# EAGLE design led_heart (EAGLE 7.5.0)
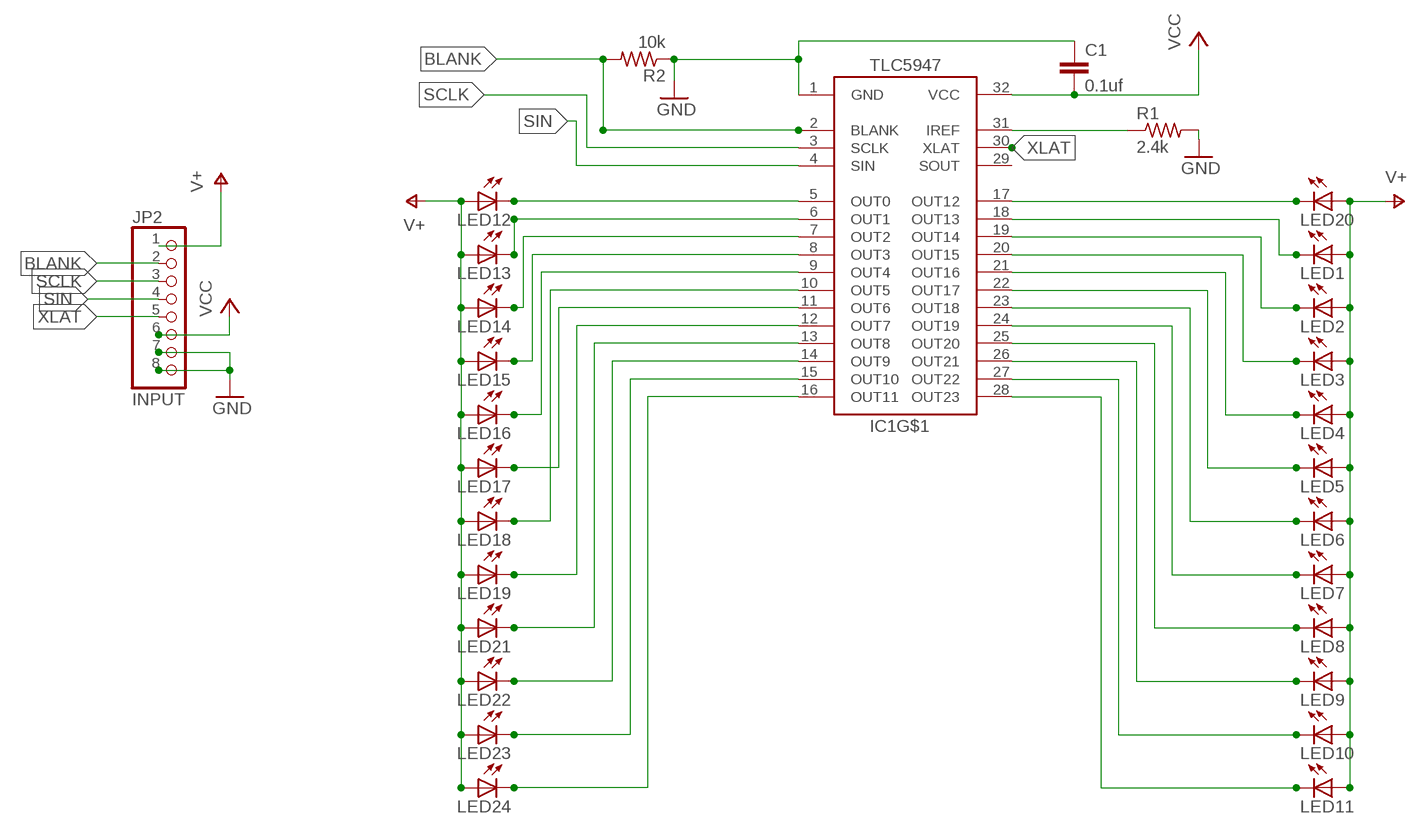
[diagram p0: schematic, sheet 1]

## Parts
C1  0.1uf  C-EUC0805  [C0805]
IC1  TLC5947-DAP  [HTSSOP32DAP]
JP2  INPUT  PINHD-1X8CLEANBIG  [1X08-CLEANBIG]
LED1  LEDCHIPLED_1206  [CHIPLED_1206]
LED2  LEDCHIPLED_1206  [CHIPLED_1206]
LED3  LEDCHIPLED_1206  [CHIPLED_1206]
LED4  LEDCHIPLED_1206  [CHIPLED_1206]
LED5  LEDCHIPLED_1206  [CHIPLED_1206]
LED6  LEDCHIPLED_1206  [CHIPLED_1206]
LED7  LEDCHIPLED_1206  [CHIPLED_1206]
LED8  LEDCHIPLED_1206  [CHIPLED_1206]
LED9  LEDCHIPLED_1206  [CHIPLED_1206]
LED10  LEDCHIPLED_1206  [CHIPLED_1206]
LED11  LEDCHIPLED_1206  [CHIPLED_1206]
LED12  LEDCHIPLED_1206  [CHIPLED_1206]
LED13  LEDCHIPLED_1206  [CHIPLED_1206]
LED14  LEDCHIPLED_1206  [CHIPLED_1206]
LED15  LEDCHIPLED_1206  [CHIPLED_1206]
LED16  LEDCHIPLED_1206  [CHIPLED_1206]
LED17  LEDCHIPLED_1206  [CHIPLED_1206]
LED18  LEDCHIPLED_1206  [CHIPLED_1206]
LED19  LEDCHIPLED_1206  [CHIPLED_1206]
LED20  LEDCHIPLED_1206  [CHIPLED_1206]
LED21  LEDCHIPLED_1206  [CHIPLED_1206]
LED22  LEDCHIPLED_1206  [CHIPLED_1206]
LED23  LEDCHIPLED_1206  [CHIPLED_1206]
LED24  LEDCHIPLED_1206  [CHIPLED_1206]
R1  2.4k  R-US_R0805  [R0805]
R2  10k  R-US_R0805  [R0805]

## Nets
BLANK: IC1.2(BLANK) JP2.2 R2.2
GND: C1.1 IC1.1(GND) JP2.7 JP2.8 R1.2 R2.1
N$1: IC1.19(OUT14) LED2.C
N$2: IC1.18(OUT13) LED1.C
N$3: IC1.17(OUT12) LED20.C
N$4: IC1.20(OUT15) LED3.C
N$5: IC1.21(OUT16) LED4.C
N$6: IC1.22(OUT17) LED5.C
N$7: IC1.23(OUT18) LED6.C
N$8: IC1.24(OUT19) LED7.C
N$9: IC1.25(OUT20) LED8.C
N$10: IC1.26(OUT21) LED9.C
N$11: IC1.27(OUT22) LED10.C
N$12: IC1.28(OUT23) LED11.C
N$13: IC1.5(OUT0) LED12.C
N$14: IC1.6(OUT1) LED13.C
N$15: IC1.7(OUT2) LED14.C
N$16: IC1.8(OUT3) LED15.C
N$17: IC1.9(OUT4) LED16.C
N$18: IC1.10(OUT5) LED18.C
N$19: IC1.11(OUT6) LED17.C
N$20: IC1.12(OUT7) LED19.C
N$21: IC1.13(OUT8) LED21.C
N$22: IC1.14(OUT9) LED22.C
N$23: IC1.15(OUT10) LED23.C
N$24: IC1.16(OUT11) LED24.C
N$29: IC1.31(IREF) R1.1
SCLK: IC1.3(SCLK) JP2.3
SIN: IC1.4(SIN) JP2.4
V+: JP2.1 LED1.A LED2.A LED3.A LED4.A LED5.A LED6.A LED7.A LED8.A LED9.A LED10.A LED11.A LED12.A LED13.A LED14.A LED15.A LED16.A LED17.A LED18.A LED19.A LED20.A LED21.A LED22.A LED23.A LED24.A
VCC: C1.2 IC1.32(VCC) JP2.6
XLAT: IC1.30(XLAT) JP2.5
Unconnected: IC1.29(SOUT) IC1.EXP(PAD)

## Library data of the parts
C1 = resistor:C-EU: CAPACITOR, European symbol
IC1 = adafruit:TLC5947
JP2 = adafruit:PINHD-1X8: PIN HEADER
LED1-LED24 = adafruit:LED: LED OSRAM: - CHIPLED LG R971, LG N971, LY N971, LG Q971, LY Q971, LO R971, LY R971 LH N974, LH R974 LS Q976, LO Q976, LY Q976 LO Q996 - Hyper CHIPLED LW Q18S LB Q993, LB Q99A, LB R99A - SideLED LS A670, LO A670, LY A670, LG A670, LP A670 LB A673, LV A673, LT A673, LW A673 LH A674 LY A675 LS A676, LA A676, LO A676, LY A676, LW A676 LS A679, LY A679, LG A679 - Hyper Micro SIDELED® LS Y876, LA Y876, LO Y876, LY Y876 LT Y87S - SmartLED LW L88C, LW L88S LB L89C, LB L89S, LG L890 LS L89K, LO L89K, LY L89K LS L896, LA L896, LO L896, LY L896 - TOPLED LS T670, LO T670, LY T670, LG T670, LP T670 LSG T670, LSP T670, LSY T670, LOP T670, LYG T670 LG T671, LOG T671, LSG T671 LB T673, LV T673, LT T673, LW T673 LH T674 LS T676, LA T676, LO T676, LY T676, LB T676, LH T676, LSB T676, LW T676 LB T67C, LV T67C, LT T67C, LS T67K, LO T67K, LY T67K, LW E67C LS E67B, LA E67B, LO E67B, LY E67B, LB E67C, LV E67C, LT E67C LW T67C LS T679, LY T679, LG T679 LS T770, LO T770, LY T770, LG T770, LP T770 LB T773, LV T773, LT T773, LW T773 LH T774 LS E675, LA E675, LY E675, LS T675 LS T776, LA T776, LO T776, LY T776, LB T776 LHGB T686 LT T68C, LB T68C - Hyper Mini TOPLED® LB M676 - Mini TOPLED Santana® LG M470 LS M47K, LO M47K, LY M47K Source: http://www.osram.convergy.de/
R1 R2 = adafruit:R-US_: RESISTOR, American symbol

## Net classes
0 default: width 0.203 mm, clearance 0.203 mm

## Board
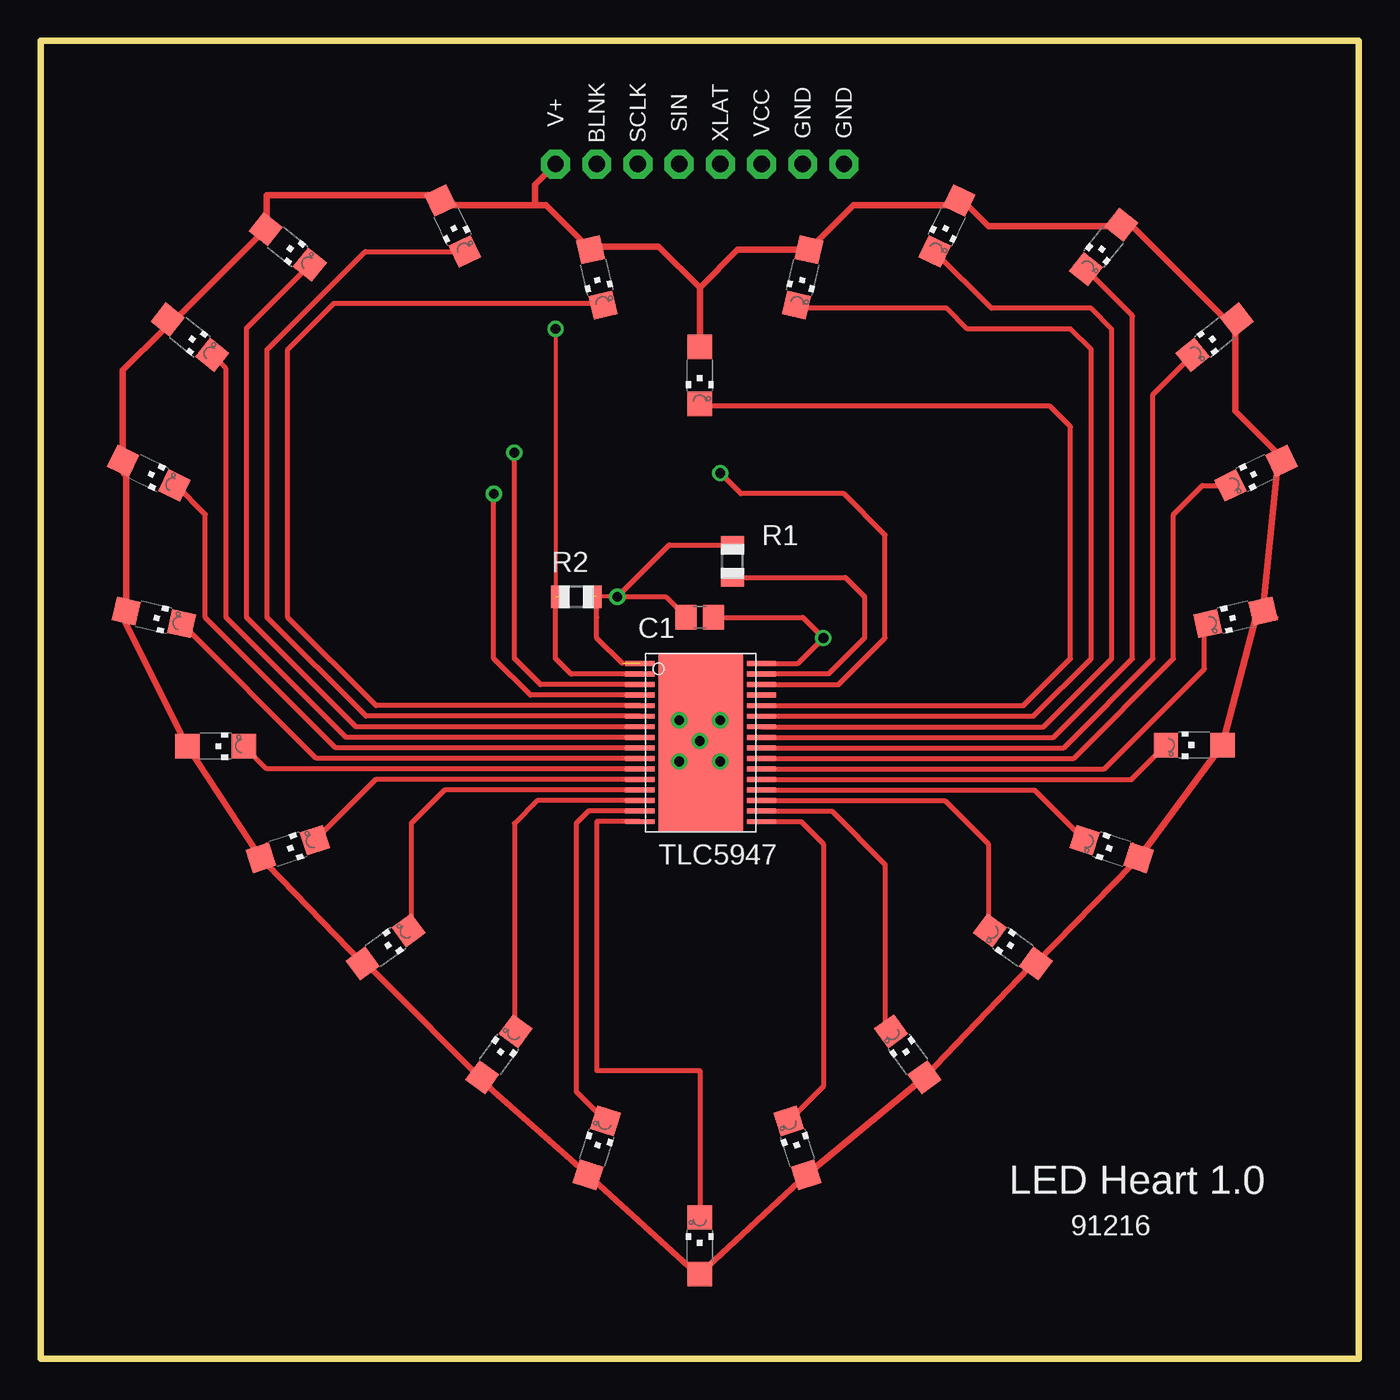
[diagram p1: board, top side]
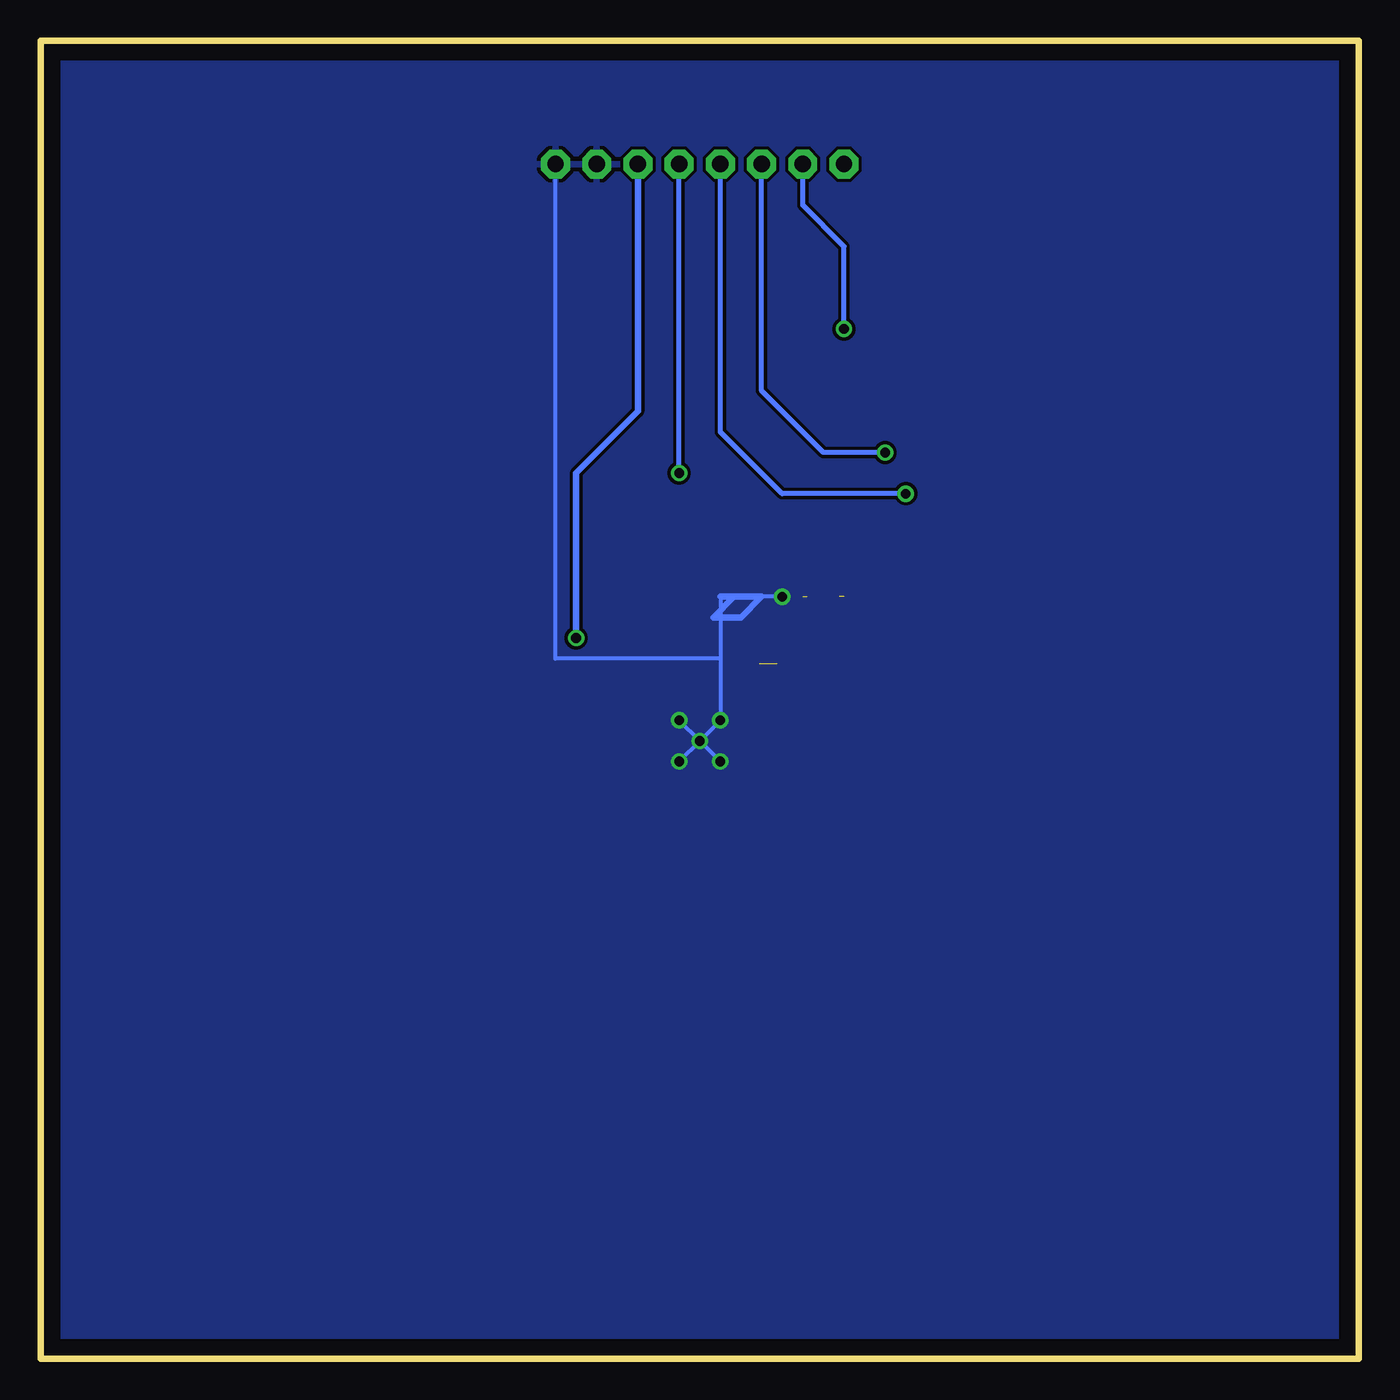
[diagram p2: board, bottom side, seen from below]

Size 81.28 x 81.28 mm. Coordinates in mm from the lower left corner, seen from the top.
Outline: 0,0 0,81.28 81.28,81.28 81.28,0 0,0
Copper layers (1*16): Top 0.035mm / dielectric 1.5mm / Bottom 0.035mm
Design rules "default *": minimum track width 10mil, minimum drill 23mil, track to track 8mil, track to pad 8mil, pad to pad 8mil, via to via 8mil, smd to smd 8mil, copper to edge 40mil, drill to drill 8mil, minimum pad ring 10mil, minimum via ring 8mil, stop-mask expansion 4mil, vias tented up to drill 0mil, thermal gap 10mil

### Footprints (pad centres in the part's own frame; a part is rotated, then mirrored left to right if it is on the bottom)
C0805 = smd 1.3 x 1.5: 1 -0.85,0; 2 0.85,0
HTSSOP32DAP = smd 0.3 x 1.8: 1 -4.875,-3.75; 2 -4.225,-3.75; 3 -3.575,-3.75; 4 -2.925,-3.75; 5 -2.275,-3.75; 6 -1.625,-3.75; 7 -0.975,-3.75; 8 -0.325,-3.75; 9 0.325,-3.75; 10 0.975,-3.75; 11 1.625,-3.75; 12 2.275,-3.75; 13 2.925,-3.75; 14 3.575,-3.75; 15 4.225,-3.75; 16 4.875,-3.75; 17 4.875,3.75; 18 4.225,3.75; 19 3.575,3.75; 20 2.925,3.75; 21 2.275,3.75; 22 1.625,3.75; 23 0.975,3.75; 24 0.325,3.75; 25 -0.325,3.75; 26 -0.975,3.75; 27 -1.625,3.75; 28 -2.275,3.75; 29 -2.925,3.75; 30 -3.575,3.75; 31 -4.225,3.75; 32 -4.875,3.75 | smd 11 x 5.2: EXP 0,0
1X08-CLEANBIG = drill 1.016 pad 1.778 octagon: 1 -8.89,0; 2 -6.35,0; 3 -3.81,0; 4 -1.27,0; 5 1.27,0; 6 3.81,0; 7 6.35,0; 8 8.89,0
CHIPLED_1206 = smd 1.5 x 1.5: A 0,-1.75; C 0,1.75
R0805 = smd 1.1 x 1.4: 1 -1,0; 2 1,0

### Placement (x,y rotation side)
C1  40.64,45.72 0 top
IC1  40.69,38 270 top
JP2  40.64,73.66 0 top
LED1  53.47,18.78 36 top
LED2  59.94,25.4 54 top
LED3  66.04,31.43 72 top
LED4  71.12,37.85 90 top
LED5  73.66,45.72 102.9 top
LED6  74.93,54.61 115.8 top
LED7  72.39,62.99 128.6 top
LED8  65.53,68.55 141.4 top
LED9  55.88,69.85 154.3 top
LED10  46.99,66.67 167.2 top
LED11  40.64,60.64 180 top
LED12  34.29,66.67 192.8 top
LED13  25.4,69.85 205.7 top
LED14  15.24,68.55 231.4 top
LED15  9.21,62.99 231.4 top
LED16  6.67,54.61 244.2 top
LED17  10.79,37.78 270 top
LED18  6.99,45.72 257.1 top
LED19  15.24,31.43 288 top
LED20  46.67,13.02 18 top
LED21  21.27,25.4 306 top
LED22  28.26,18.78 324 top
LED23  34.29,13.02 342 top
LED24  40.64,6.99 0 top
R1  42.66,49.18 90 top
R2  33.02,46.99 180 top

### Tracks (layer width: path | path; a pad name or v marks a point on that pad's centre or on a via)
BLANK  (via drill 0.6)  (1 unrouted)
  Top 0.254: v31.75,63.5 31.75,46.99 31.75,45.72
  Top 0.305: IC1.2 32.71,42.22 31.75,43.18 31.75,45.72 31.75,46.8
  Bottom 0.305: v31.75,63.5 31.75,68.58 34.29,71.12 JP2.2
GND  (via drill 0.6)  (2 unrouted)
  Top 0.254: v35.56,46.99 34.29,46.99 34.29,45.72
  Top 0.305: 35.87,42.87 34.29,44.45 34.29,45.72 34.29,46.23 | R1.2 38.75,50.18 v35.56,46.99 36.83,46.99 37.25,46.99 38.52,46.99 C1.1
  Bottom 0.254: v40.64,38.1 v39.37,36.83 | v40.64,38.1 v41.91,36.83 | v40.64,38.1 v39.37,39.37 39.37,43.18 | v40.64,38.1 v41.91,39.37 | 39.37,46.99 39.37,43.18 | v35.56,46.99 36.83,46.99 | JP2.8 49.53,43.18 39.37,43.18
  Bottom 0.406: 39.37,46.99 38.52,46.99 | 38.52,46.99 36.83,46.99 38.1,45.72 C1.1 38.52,46.99
  pour Bottom: -1.27,82.55 82.55,82.55 82.55,-1.27 -1.27,-1.27
N$1
  Top 0.305: IC1.19 55.75,34.42 58.42,31.75 58.42,26.54
  Top 0.406: 58.42,26.54 LED2.C
N$2
  Top 0.305: IC1.18 48.78,33.77 52.07,30.48 52.07,20.57
  Top 0.406: 52.07,20.57 LED1.C
N$3
  Top 0.305: IC1.17 46.89,33.12 48.26,31.75 48.26,16.81 LED20.C
N$4
  Top 0.305: IC1.20 61.27,35.07 LED3.C
N$5
  Top 0.305: IC1.21 67.25,35.72 LED4.C
N$6
  Top 0.305: IC1.22 65.58,36.37 71.75,42.55 71.75,45.13 LED5.C
N$7
  Top 0.305: IC1.23 63.69,37.02 69.85,43.18 69.85,52.07 71.63,53.85 LED6.C
N$8
  Top 0.305: IC1.24 63.07,37.67 68.58,43.18 68.58,59.46 LED7.C
N$9
  Top 0.305: IC1.25 62.45,38.32 67.31,43.18 67.31,64.32 LED8.C
N$10
  Top 0.305: IC1.26 61.83,38.97 66.04,43.18 66.04,63.5 64.77,64.77 58.62,64.77 LED9.C
N$11
  Top 0.305: IC1.27 61.21,39.62 64.77,43.18 64.77,62.23 63.5,63.5 57.15,63.5 55.88,64.77 46.8,64.77 LED10.C
N$12
  Top 0.305: IC1.28 60.59,40.27 63.5,43.18 63.5,57.47 62.23,58.74 40.8,58.74 LED11.C
N$13
  Top 0.305: IC1.5 20.69,40.27 15.24,45.72 15.24,62.23 18.1,65.09 34.56,65.09 LED12.C
N$14
  Top 0.305: IC1.6 20.07,39.62 13.97,45.72 13.97,62.23 20.01,68.27 LED13.C
N$15
  Top 0.305: IC1.7 19.45,38.97 12.7,45.72 12.7,63.55 LED14.C
N$16
  Top 0.305: IC1.8 18.83,38.32 11.43,45.72 11.43,61.05 LED15.C
N$17
  Top 0.305: IC1.9 18.21,37.67 10.16,45.72 10.16,52.07 8.38,53.85 LED16.C
N$18
  Top 0.305: IC1.10 17,37.02 LED18.C
N$19
  Top 0.305: IC1.11 13.95,36.37 LED17.C
N$20
  Top 0.305: IC1.12 20.66,35.72 LED19.C
N$21
  Top 0.305: IC1.13 24.91,35.07 22.86,33.02 22.86,26.6 LED21.C
N$22
  Top 0.305: IC1.14 30.61,34.42 29.21,33.02 29.21,20.27 LED22.C
N$23
  Top 0.305: IC1.15 33.77,33.77 33.02,33.02 33.02,16.49 LED23.C
N$24
  Top 0.305: IC1.16 34.29,33.12 34.29,17.78 40.64,17.78 LED24.C
N$29
  Top 0.305: R1.1 49.61,48.18 50.8,46.99 50.8,44.45 48.58,42.23 IC1.31
SCLK  (via drill 0.6)
  Top 0.305: IC1.3 30.82,41.57 29.21,43.18 v29.21,55.88
  Bottom 0.305: v29.21,55.88 33.02,55.88 36.83,59.69 JP2.3
SIN  (via drill 0.6)
  Top 0.305: IC1.4 30.2,40.92 27.94,43.18 v27.94,53.34
  Bottom 0.305: v27.94,53.34 35.56,53.34 39.37,57.15 JP2.4
V+
  Top 0.254: 54.61,17.78 LED1.A | 57.15,71.12 LED9.A 55.88,71.12 | 66.04,69.85 LED8.A 67.31,69.85 | 67.31,31.75 LED3.A 67.31,30.48 | 74.93,45.72 LED5.A 76.2,45.72 | 72.39,38.1 LED4.A | 76.2,54.61 LED6.A | 73.66,63.5 LED7.A | 60.96,24.13 LED2.A | 40.64,62.23 LED11.A | 13.97,69.85 LED14.A | 46.99,68.58 LED10.A | 5.08,55.88 LED16.A 5.08,54.61 | 7.62,63.5 LED15.A | 13.97,31.75 LED19.A 13.97,30.48 | 20.32,24.13 LED21.A | 26.67,17.78 LED22.A | 5.08,45.72 LED18.A | 8.89,38.1 LED17.A | 34.29,68.58 LED12.A | 40.64,5.08 LED24.A
  Top 0.305: 13.97,69.85 13.94,69.85 | 24.57,71.75 24.57,71.53 LED13.A 25.4,71.12 | 73.08,64.08 LED7.A | 75.37,46.41 LED5.A | 5.08,54.61 5.28,54.41 | 27.94,16.51 LED22.A
  Top 0.406: 24.57,71.75 13.94,71.75 13.94,69.85 | 34.29,68.58 38.1,68.58 40.64,66.04 | LED11.A 40.64,66.04 | 40.64,66.04 42.98,68.38 LED10.A 50.12,71.12 55.88,71.12 | 57.15,71.12 58.42,69.85 66.04,69.85 | 67.31,69.85 73.08,64.08 | LED14.A 8.31,64.08 | 74.93,45.72 LED4.A LED3.A | 67.31,30.48 LED2.A | 60.96,24.13 LED1.A LED20.A LED24.A | 76.2,54.61 LED5.A | 25.4,71.12 30.48,71.12 | LED12.A 31.16,71.12 30.48,71.12 | 7.62,63.5 5.08,60.96 5.08,55.88 | 5.28,54.41 LED18.A | 5.08,45.72 LED17.A LED19.A | 13.97,30.48 LED21.A | 20.32,24.13 27.94,16.51 LED23.A 40.64,5.08 | 30.48,71.12 30.48,72.39 JP2.1 | 73.66,63.5 73.66,58.42 76.2,55.88 76.2,55.68 LED6.A
VCC  (via drill 0.6)
  Top 0.305: IC1.32 46.68,42.87 v48.26,44.45 46.99,45.72 C1.2
  Bottom 0.406: JP2.6 44.45,58.42 48.26,54.61 v48.26,44.45
XLAT  (via drill 0.6)
  Top 0.305: IC1.30 49.19,41.57 52.07,44.45 52.07,50.8 49.53,53.34 43.18,53.34 v41.91,54.61
  Bottom 0.305: v41.91,54.61 JP2.5

### Text on the board
_tsilk: V+ | BLNK | SCLK | SIN | XLAT | VCC | GND | GND | R1 | C1 | TLC5947 | LED Heart 1.0 | 91216
200bmp: C:/Users/aditockzz/Downloads/heart-outline (2).bmp